# EAGLE schematic Key Matrix (EAGLE 7.5.0)
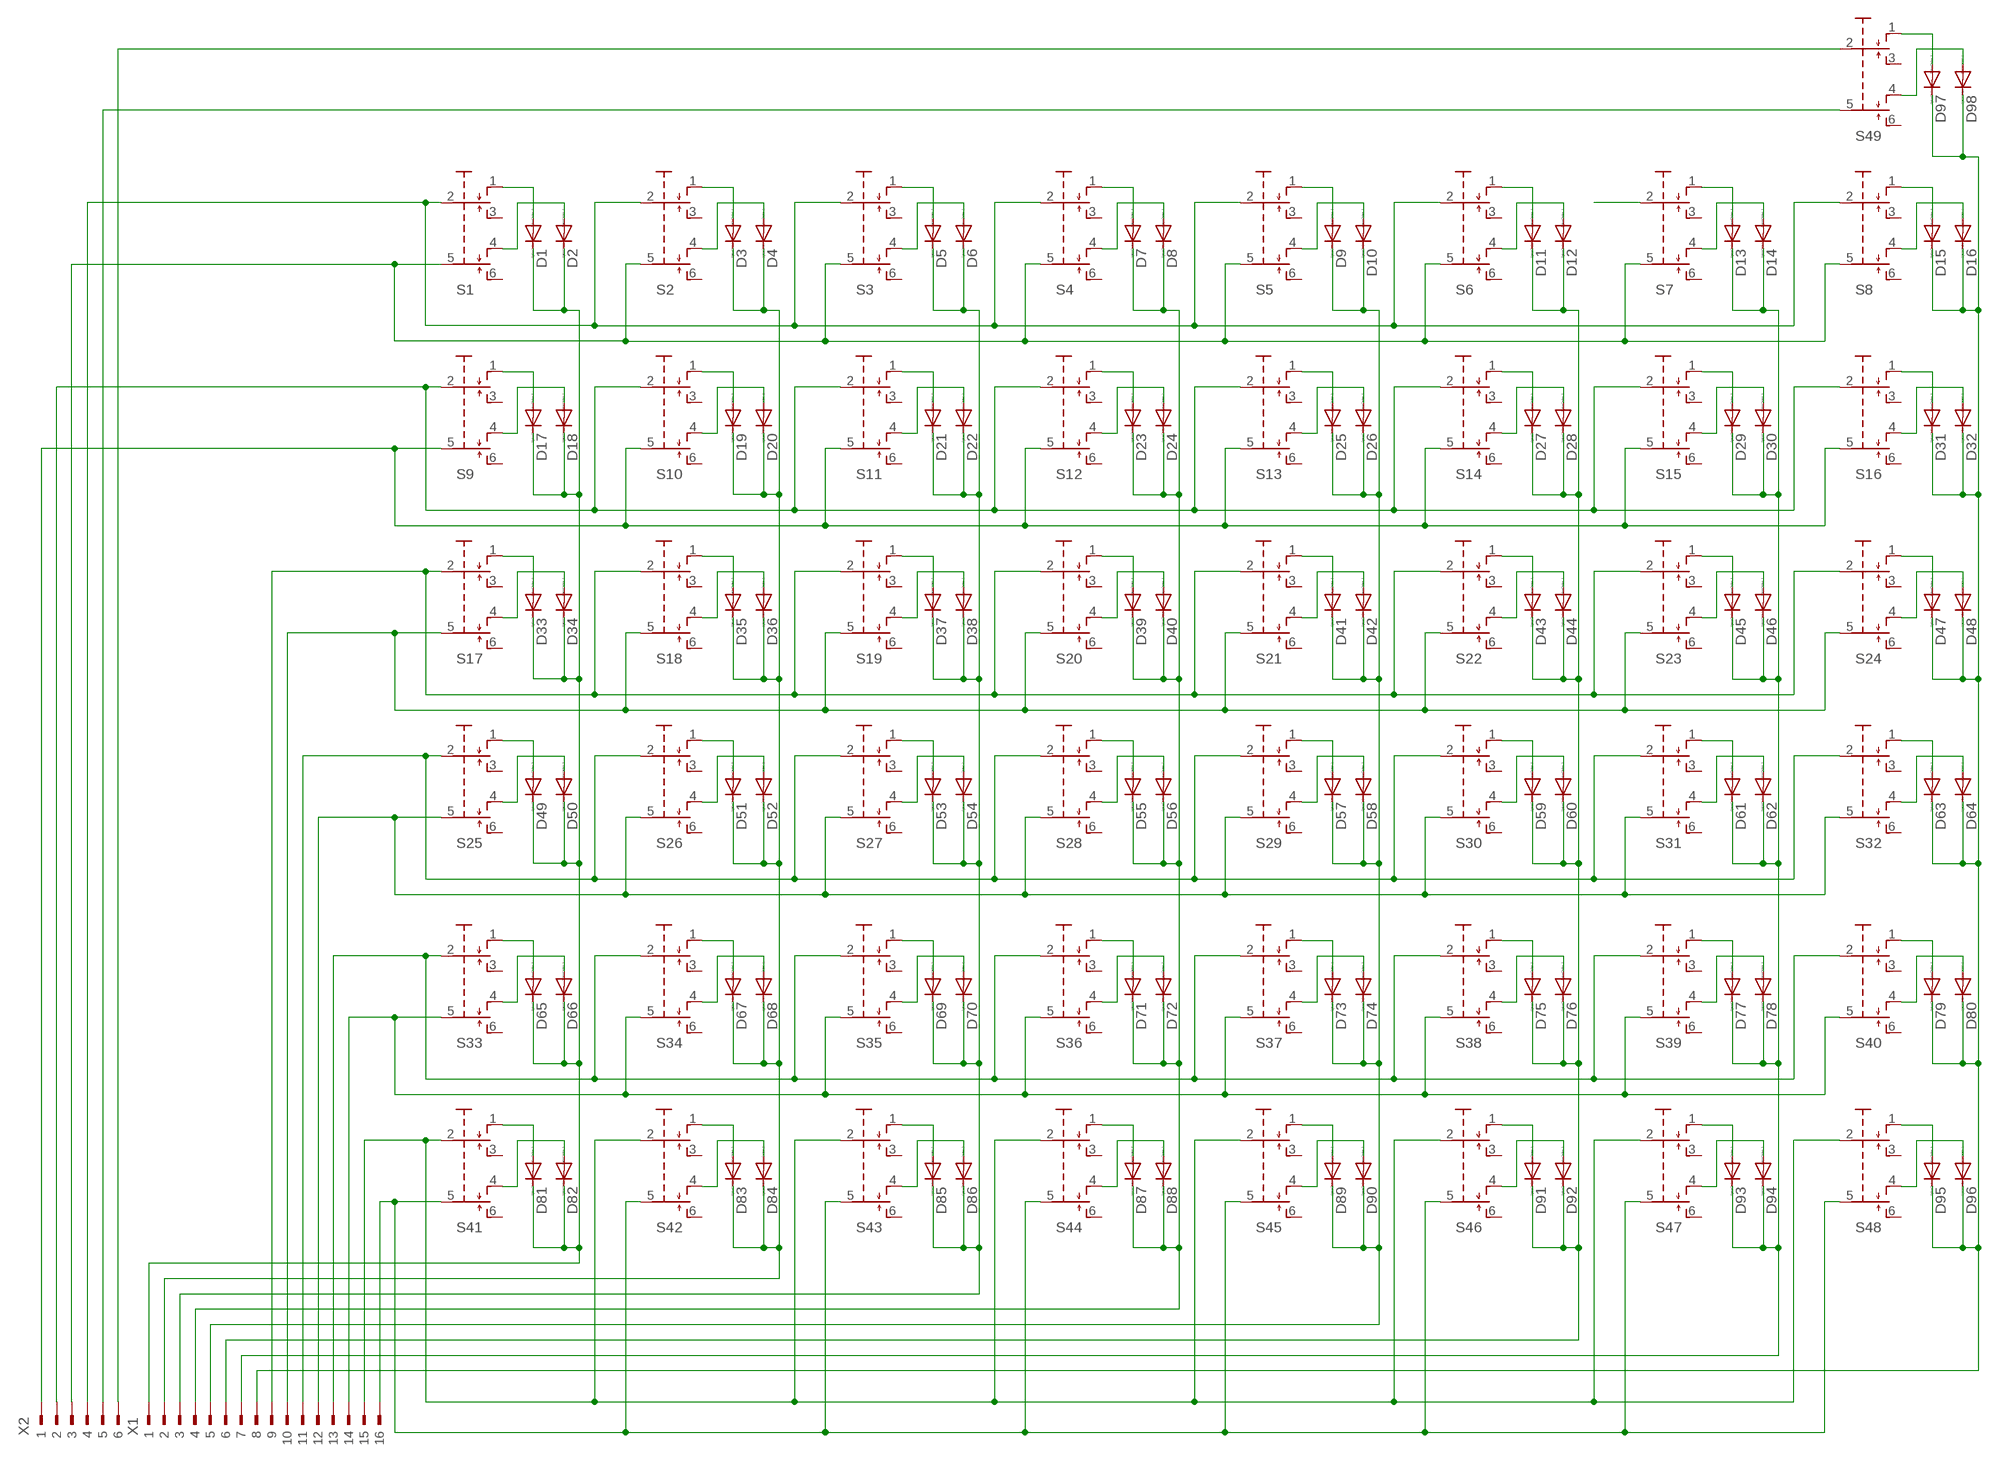
[diagram p0: schematic, sheet 1]

## Parts
D1  1N4004  [DO41-10]
D2  1N4004  [DO41-10]
D3  1N4004  [DO41-10]
D4  1N4004  [DO41-10]
D5  1N4004  [DO41-10]
D6  1N4004  [DO41-10]
D7  1N4004  [DO41-10]
D8  1N4004  [DO41-10]
D9  1N4004  [DO41-10]
D10  1N4004  [DO41-10]
D11  1N4004  [DO41-10]
D12  1N4004  [DO41-10]
D13  1N4004  [DO41-10]
D14  1N4004  [DO41-10]
D15  1N4004  [DO41-10]
D16  1N4004  [DO41-10]
D17  1N4004  [DO41-10]
D18  1N4004  [DO41-10]
D19  1N4004  [DO41-10]
D20  1N4004  [DO41-10]
D21  1N4004  [DO41-10]
D22  1N4004  [DO41-10]
D23  1N4004  [DO41-10]
D24  1N4004  [DO41-10]
D25  1N4004  [DO41-10]
D26  1N4004  [DO41-10]
D27  1N4004  [DO41-10]
D28  1N4004  [DO41-10]
D29  1N4004  [DO41-10]
D30  1N4004  [DO41-10]
D31  1N4004  [DO41-10]
D32  1N4004  [DO41-10]
D33  1N4004  [DO41-10]
D34  1N4004  [DO41-10]
D35  1N4004  [DO41-10]
D36  1N4004  [DO41-10]
D37  1N4004  [DO41-10]
D38  1N4004  [DO41-10]
D39  1N4004  [DO41-10]
D40  1N4004  [DO41-10]
D41  1N4004  [DO41-10]
D42  1N4004  [DO41-10]
D43  1N4004  [DO41-10]
D44  1N4004  [DO41-10]
D45  1N4004  [DO41-10]
D46  1N4004  [DO41-10]
D47  1N4004  [DO41-10]
D48  1N4004  [DO41-10]
D49  1N4004  [DO41-10]
D50  1N4004  [DO41-10]
D51  1N4004  [DO41-10]
D52  1N4004  [DO41-10]
D53  1N4004  [DO41-10]
D54  1N4004  [DO41-10]
D55  1N4004  [DO41-10]
D56  1N4004  [DO41-10]
D57  1N4004  [DO41-10]
D58  1N4004  [DO41-10]
D59  1N4004  [DO41-10]
D60  1N4004  [DO41-10]
D61  1N4004  [DO41-10]
D62  1N4004  [DO41-10]
D63  1N4004  [DO41-10]
D64  1N4004  [DO41-10]
D65  1N4004  [DO41-10]
D66  1N4004  [DO41-10]
D67  1N4004  [DO41-10]
D68  1N4004  [DO41-10]
D69  1N4004  [DO41-10]
D70  1N4004  [DO41-10]
D71  1N4004  [DO41-10]
D72  1N4004  [DO41-10]
D73  1N4004  [DO41-10]
D74  1N4004  [DO41-10]
D75  1N4004  [DO41-10]
D76  1N4004  [DO41-10]
D77  1N4004  [DO41-10]
D78  1N4004  [DO41-10]
D79  1N4004  [DO41-10]
D80  1N4004  [DO41-10]
D81  1N4004  [DO41-10]
D82  1N4004  [DO41-10]
D83  1N4004  [DO41-10]
D84  1N4004  [DO41-10]
D85  1N4004  [DO41-10]
D86  1N4004  [DO41-10]
D87  1N4004  [DO41-10]
D88  1N4004  [DO41-10]
D89  1N4004  [DO41-10]
D90  1N4004  [DO41-10]
D91  1N4004  [DO41-10]
D92  1N4004  [DO41-10]
D93  1N4004  [DO41-10]
D94  1N4004  [DO41-10]
D95  1N4004  [DO41-10]
D96  1N4004  [DO41-10]
D97  1N4004  [DO41-10]
D98  1N4004  [DO41-10]
S1  TL47YO  [TL4XYO]
S2  TL47YO  [TL4XYO]
S3  TL47YO  [TL4XYO]
S4  TL47YO  [TL4XYO]
S5  TL47YO  [TL4XYO]
S6  TL47YO  [TL4XYO]
S7  TL47YO  [TL4XYO]
S8  TL47YO  [TL4XYO]
S9  TL47YO  [TL4XYO]
S10  TL47YO  [TL4XYO]
S11  TL47YO  [TL4XYO]
S12  TL47YO  [TL4XYO]
S13  TL47YO  [TL4XYO]
S14  TL47YO  [TL4XYO]
S15  TL47YO  [TL4XYO]
S16  TL47YO  [TL4XYO]
S17  TL47YO  [TL4XYO]
S18  TL47YO  [TL4XYO]
S19  TL47YO  [TL4XYO]
S20  TL47YO  [TL4XYO]
S21  TL47YO  [TL4XYO]
S22  TL47YO  [TL4XYO]
S23  TL47YO  [TL4XYO]
S24  TL47YO  [TL4XYO]
S25  TL47YO  [TL4XYO]
S26  TL47YO  [TL4XYO]
S27  TL47YO  [TL4XYO]
S28  TL47YO  [TL4XYO]
S29  TL47YO  [TL4XYO]
S30  TL47YO  [TL4XYO]
S31  TL47YO  [TL4XYO]
S32  TL47YO  [TL4XYO]
S33  TL47YO  [TL4XYO]
S34  TL47YO  [TL4XYO]
S35  TL47YO  [TL4XYO]
S36  TL47YO  [TL4XYO]
S37  TL47YO  [TL4XYO]
S38  TL47YO  [TL4XYO]
S39  TL47YO  [TL4XYO]
S40  TL47YO  [TL4XYO]
S41  TL47YO  [TL4XYO]
S42  TL47YO  [TL4XYO]
S43  TL47YO  [TL4XYO]
S44  TL47YO  [TL4XYO]
S45  TL47YO  [TL4XYO]
S46  TL47YO  [TL4XYO]
S47  TL47YO  [TL4XYO]
S48  TL47YO  [TL4XYO]
S49  TL47YO  [TL4XYO]
X1  180G-16  [180G-16]
X2  180G-6  [180G-6]

## Nets
N$1: D1.A S1.1(O)
N$2: D2.A S1.4(O1)
N$3: S7.2(P)
N$4: S1.2(P) S2.2(P) S3.2(P) S4.2(P) S5.2(P) S6.2(P) S8.2(P) X2.4
N$9: D3.A S2.1(O)
N$10: D4.A S2.4(O1)
N$15: D5.A S3.1(O)
N$16: D6.A S3.4(O1)
N$19: S1.5(P1) S2.5(P1) S3.5(P1) S4.5(P1) S5.5(P1) S6.5(P1) S7.5(P1) S8.5(P1) X2.3
N$21: D7.A S4.1(O)
N$22: D8.A S4.4(O1)
N$27: D9.A S5.1(O)
N$28: D10.A S5.4(O1)
N$33: D11.A S6.1(O)
N$34: D12.A S6.4(O1)
N$39: D13.A S7.1(O)
N$40: D14.A S7.4(O1)
N$45: D15.A S8.1(O)
N$46: D16.A S8.4(O1)
N$48: D15.C D16.C D31.C D32.C D47.C D48.C D63.C D64.C D79.C D80.C D95.C D96.C D97.C D98.C X1.8
N$51: D17.A S9.1(O)
N$52: D18.A S9.4(O1)
N$57: D19.A S10.1(O)
N$58: D20.A S10.4(O1)
N$63: D21.A S11.1(O)
N$64: D22.A S11.4(O1)
N$65: D5.C D6.C D21.C D22.C D37.C D38.C D53.C D54.C D69.C D70.C D85.C D86.C X1.3
N$69: D23.A S12.1(O)
N$70: D24.A S12.4(O1)
N$71: D7.C D8.C D23.C D24.C D39.C D40.C D55.C D56.C D71.C D72.C D87.C D88.C X1.4
N$75: D25.A S13.1(O)
N$76: D26.A S13.4(O1)
N$77: D9.C D10.C D25.C D26.C D41.C D42.C D57.C D58.C D73.C D74.C D89.C D90.C X1.5
N$81: D27.A S14.1(O)
N$82: D28.A S14.4(O1)
N$83: D11.C D12.C D27.C D28.C D43.C D44.C D59.C D60.C D75.C D76.C D91.C D92.C X1.6
N$85: S9.2(P) S10.2(P) S11.2(P) S12.2(P) S13.2(P) S14.2(P) S15.2(P) S16.2(P) X2.2
N$86: S9.5(P1) S10.5(P1) S11.5(P1) S12.5(P1) S13.5(P1) S14.5(P1) S15.5(P1) S16.5(P1) X2.1
N$87: D29.A S15.1(O)
N$88: D30.A S15.4(O1)
N$89: D13.C D14.C D29.C D30.C D45.C D46.C D61.C D62.C D77.C D78.C D93.C D94.C X1.7
N$93: D31.A S16.1(O)
N$94: D32.A S16.4(O1)
N$99: D33.A S17.1(O)
N$100: D34.A S17.4(O1)
N$103: S17.2(P) S18.2(P) S19.2(P) S20.2(P) S21.2(P) S22.2(P) S23.2(P) S24.2(P) X1.9
N$104: S17.5(P1) S18.5(P1) S19.5(P1) S20.5(P1) S21.5(P1) S22.5(P1) S23.5(P1) S24.5(P1) X1.10
N$105: D35.A S18.1(O)
N$106: D36.A S18.4(O1)
N$107: D3.C D4.C D19.C D20.C D35.C D36.C D51.C D52.C D67.C D68.C D83.C D84.C X1.2
N$111: D37.A S19.1(O)
N$112: D38.A S19.4(O1)
N$117: D39.A S20.1(O)
N$118: D40.A S20.4(O1)
N$123: D41.A S21.1(O)
N$124: D42.A S21.4(O1)
N$129: D43.A S22.1(O)
N$130: D44.A S22.4(O1)
N$135: D45.A S23.1(O)
N$136: D46.A S23.4(O1)
N$141: D47.A S24.1(O)
N$142: D48.A S24.4(O1)
N$147: D49.A S25.1(O)
N$148: D50.A S25.4(O1)
N$151: S25.2(P) S26.2(P) S27.2(P) S28.2(P) S29.2(P) S30.2(P) S31.2(P) S32.2(P) X1.11
N$152: S25.5(P1) S26.5(P1) S27.5(P1) S28.5(P1) S29.5(P1) S30.5(P1) S31.5(P1) S32.5(P1) X1.12
N$153: D51.A S26.1(O)
N$154: D52.A S26.4(O1)
N$159: D53.A S27.1(O)
N$160: D54.A S27.4(O1)
N$165: D55.A S28.1(O)
N$166: D56.A S28.4(O1)
N$171: D57.A S29.1(O)
N$172: D58.A S29.4(O1)
N$177: D59.A S30.1(O)
N$178: D60.A S30.4(O1)
N$183: D61.A S31.1(O)
N$184: D62.A S31.4(O1)
N$189: D63.A S32.1(O)
N$190: D64.A S32.4(O1)
N$195: D65.A S33.1(O)
N$196: D66.A S33.4(O1)
N$197: D1.C D2.C D17.C D18.C D33.C D34.C D49.C D50.C D65.C D66.C D81.C D82.C X1.1
N$199: S33.2(P) S34.2(P) S35.2(P) S36.2(P) S37.2(P) S38.2(P) S39.2(P) S40.2(P) X1.13
N$200: S33.5(P1) S34.5(P1) S35.5(P1) S36.5(P1) S37.5(P1) S38.5(P1) S39.5(P1) S40.5(P1) X1.14
N$201: D67.A S34.1(O)
N$202: D68.A S34.4(O1)
N$207: D69.A S35.1(O)
N$208: D70.A S35.4(O1)
N$213: D71.A S36.1(O)
N$214: D72.A S36.4(O1)
N$219: D73.A S37.1(O)
N$220: D74.A S37.4(O1)
N$225: D75.A S38.1(O)
N$226: D76.A S38.4(O1)
N$231: D77.A S39.1(O)
N$232: D78.A S39.4(O1)
N$237: D79.A S40.1(O)
N$238: D80.A S40.4(O1)
N$243: D81.A S41.1(O)
N$244: D82.A S41.4(O1)
N$247: S41.2(P) S42.2(P) S43.2(P) S44.2(P) S45.2(P) S46.2(P) S47.2(P) S48.2(P) X1.15
N$248: S41.5(P1) S42.5(P1) S43.5(P1) S44.5(P1) S45.5(P1) S46.5(P1) S47.5(P1) S48.5(P1) X1.16
N$249: D83.A S42.1(O)
N$250: D84.A S42.4(O1)
N$255: D85.A S43.1(O)
N$256: D86.A S43.4(O1)
N$261: D87.A S44.1(O)
N$262: D88.A S44.4(O1)
N$267: D89.A S45.1(O)
N$268: D90.A S45.4(O1)
N$273: D91.A S46.1(O)
N$274: D92.A S46.4(O1)
N$279: D93.A S47.1(O)
N$280: D94.A S47.4(O1)
N$285: D95.A S48.1(O)
N$286: D96.A S48.4(O1)
N$289: S49.2(P) X2.6
N$290: S49.5(P1) X2.5
N$291: D97.A S49.1(O)
N$292: D98.A S49.4(O1)
Unconnected: S1.3(S) S1.6(S1) S2.3(S) S2.6(S1) S3.3(S) S3.6(S1) S4.3(S) S4.6(S1) S5.3(S) S5.6(S1) S6.3(S) S6.6(S1) S7.3(S) S7.6(S1) S8.3(S) S8.6(S1) S9.3(S) S9.6(S1) S10.3(S) S10.6(S1) S11.3(S) S11.6(S1) S12.3(S) S12.6(S1) S13.3(S) S13.6(S1) S14.3(S) S14.6(S1) S15.3(S) S15.6(S1) S16.3(S) S16.6(S1) S17.3(S) S17.6(S1) S18.3(S) S18.6(S1) S19.3(S) S19.6(S1) S20.3(S) S20.6(S1) S21.3(S) S21.6(S1) S22.3(S) S22.6(S1) S23.3(S) S23.6(S1) S24.3(S) S24.6(S1) S25.3(S) S25.6(S1) S26.3(S) S26.6(S1) S27.3(S) S27.6(S1) S28.3(S) S28.6(S1) S29.3(S) S29.6(S1) S30.3(S) S30.6(S1) S31.3(S) S31.6(S1) S32.3(S) S32.6(S1) S33.3(S) S33.6(S1) S34.3(S) S34.6(S1) S35.3(S) S35.6(S1) S36.3(S) S36.6(S1) S37.3(S) S37.6(S1) S38.3(S) S38.6(S1) S39.3(S) S39.6(S1) S40.3(S) S40.6(S1) S41.3(S) S41.6(S1) S42.3(S) S42.6(S1) S43.3(S) S43.6(S1) S44.3(S) S44.6(S1) S45.3(S) S45.6(S1) S46.3(S) S46.6(S1) S47.3(S) S47.6(S1) S48.3(S) S48.6(S1) S49.3(S) S49.6(S1)

## Library data of the parts
D1-D98 = diode:1N4004: DIODE general purpose rectifier, 1 A
S1-S49 = switch:TL47YO: TINY SWITCH MOM OFF MOM Source: http://www2.produktinfo.conrad.com/datenblaetter/700000-724999/705152-da-01-de-Subminiaturschalter_TL_36YO.pdf
X1 = con-weidmueller-sl35:180G-16: WEIDMUELLER CLAMP CONNECTOR; OC_FARNELL: unknown; OC_NEWARK: unknown
X2 = con-weidmueller-sl35:180G-6: WEIDMUELLER CLAMP CONNECTOR; OC_FARNELL: unknown; OC_NEWARK: unknown